# Altium schematic sheet [04] - MCU STM32.SchDoc
size A3; CompanyName: FPT-FTI copporation; Address1: FPT Building Duy Tan; Address2: Floor 4,; DocumentNumber: 4; SheetNumber: 4; SheetTotal: 8; NameAuthor: Angle Vu
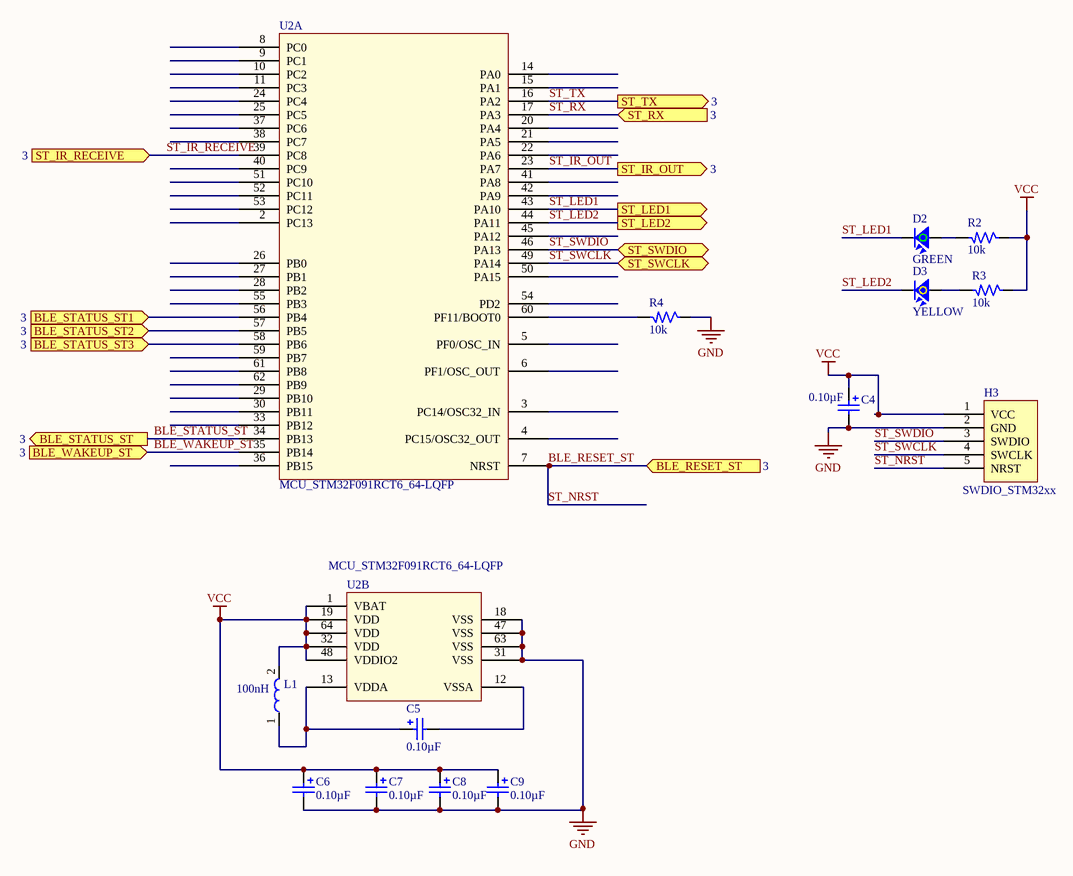
[diagram p0: [04] - MCU STM32.SchDoc]

## Parts
C4  Capacitance: 0.10µF  [CAP_SMD0603]  (hidden comment: C_104_0603_CERAMIC_16V)
C5  Capacitance: 0.10µF  [CAP_SMD0603]  (hidden comment: C_104_0603_CERAMIC_16V)
C6  Capacitance: 0.10µF  [CAP_SMD0603]  (hidden comment: C_104_0603_CERAMIC_16V)
C7  Capacitance: 0.10µF  [CAP_SMD0603]  (hidden comment: C_104_0603_CERAMIC_16V)
C8  Capacitance: 0.10µF  [CAP_SMD0603]  (hidden comment: C_104_0603_CERAMIC_16V)
C9  Capacitance: 0.10µF  [CAP_SMD0603]  (hidden comment: C_104_0603_CERAMIC_16V)
D2  GREEN  [LED_GREEN_SMD0603]
D3  YELLOW  [LED_YELLOW_SMD0603]
H3  SWDIO_STM32xx  [HEADER5_ISP_STM32F0xx_SUR1.27 - duplicate]
L1  Inductance: 100nH  [CHOKE_SMD0805]  (hidden comment: CHOKE_100NH_SMD0805)
R2  Resistance (Ohms): 10k  [RES_SMD0603]  (hidden comment: R_10K_SMD0603_1%_1/10W)
R3  Resistance (Ohms): 10k  [RES_SMD0603]  (hidden comment: R_10K_SMD0603_1%_1/10W)
R4  Resistance (Ohms): 10k  [RES_SMD0603]  (hidden comment: R_10K_SMD0603_1%_1/10W)
U2  MCU_STM32F091RCT6_64-LQFP  [MCU_STM32F091RCT6_LQFP64]  (parts A,B of 2)

## Ports
BLE_RESET_ST (in, see 3), BLE_STATUS_ST1 (in, see 3), BLE_STATUS_ST2 (in, see 3), BLE_STATUS_ST3 (in, see 3), BLE_STATUS_ST (out, see 3), BLE_WAKEUP_ST (in, see 3), ST_IR_OUT (out, see 3), ST_IR_RECEIVE (in, see 3), ST_LED1 (out), ST_LED2 (out), ST_RX (in, see 3), ST_SWCLK (bidir), ST_SWDIO (bidir), ST_TX (out, see 3)

## Nets
GND: C4.2 C6.2 C7.2 C8.2 C9.2 H3.2(GND) R4.1 U2.18(VSS) U2.31(VSS) U2.47(VSS) U2.63(VSS)
VCC: C4.1 C6.1 C7.1 C8.1 C9.1 H3.1(VCC) L1.2 R2.1 R3.1 U2.1(VBAT) U2.19(VDD) U2.32(VDD) U2.48(VDDIO2) U2.64(VDD)
BLE_RESET_ST: H3.5(NRST) U2.7(NRST) ; port BLE_RESET_ST  [also labelled ST_NRST]
BLE_STATUS_ST: U2.34(PB13) ; port BLE_STATUS_ST
BLE_STATUS_ST1: U2.56(PB4) ; port BLE_STATUS_ST1
BLE_STATUS_ST2: U2.57(PB5) ; port BLE_STATUS_ST2
BLE_STATUS_ST3: U2.58(PB6) ; port BLE_STATUS_ST3
BLE_WAKEUP_ST: U2.35(PB14) ; port BLE_WAKEUP_ST
ST_IR_OUT: U2.23(PA7) ; port ST_IR_OUT
ST_IR_RECEIVE: U2.39(PC8) ; port ST_IR_RECEIVE
ST_LED1: D2.2 U2.43(PA10) ; port ST_LED1
ST_LED2: D3.2 U2.44(PA11) ; port ST_LED2
ST_RX: U2.17(PA3) ; port ST_RX
ST_SWCLK: H3.4(SWCLK) U2.49(PA14) ; port ST_SWCLK
ST_SWDIO: H3.3(SWDIO) U2.46(PA13) ; port ST_SWDIO
ST_TX: U2.16(PA2) ; port ST_TX
NetC5_1: C5.1 L1.1 U2.13(VDDA)
NetC5_2: C5.2 U2.12(VSSA)
NetD2_1: D2.1 R2.2
NetD3_1: D3.1 R3.2
NetR4_2: R4.2 U2.60(PF11/BOOT0)

Not connected (* = marked no-connect by the designer): U2 2(PC13) 3(PC14/OSC32_IN) 4(PC15/OSC32_OUT) 5(PF0/OSC_IN) 6(PF1/OSC_OUT) 8(PC0) 9(PC1) 10(PC2) 11(PC3) 14(PA0) 15(PA1) 20(PA4) 21(PA5) 22(PA6) 24(PC4) 25(PC5) 26(PB0) 27(PB1) 28(PB2) 29(PB10) 30(PB11) 33(PB12) 36(PB15) 37(PC6) 38(PC7) 40(PC9) 41(PA8) 42(PA9) 45(PA12) 50(PA15) 51(PC10) 52(PC11) 53(PC12) 54(PD2) 55(PB3) 59(PB7) 61(PB8) 62(PB9)

## Notes on the sheet
- Designed By
- Checked By
- Company:
- Size:
- A3
- Address:
- Sheet:
- /

## Library data of the parts
C4-C9 = C_104_0603_CERAMIC_16V: CAP CER 0.1UF 16V X7R 0603; Manufacturer: Murata Electronics North America; Manufacturer Part Number: GRM188R71C104KA01D; Tolerance: ±10%; Supplier 1: Digi-Key; RoHS: RoHS Compliant; Category: Capacitors; Stock 1: 3132000; Pricing 1: 4000=0.00359, 8000=0.00328, 12000=0.00312, 28000=0.00296, 100000=0.00215 (USD); Packaging: Tape & Reel (TR); Part Status: Active; Voltage - Rated: 16V; Temperature Coefficient: X7R; Mounting Type: Surface Mount, MLCC; Operating Temperature: -55°C ~ 125°C; Applications: General Purpose; Ratings: -; Package / Case: 0603 (1608 Metric); Size / Dimension: 0.063" L x 0.031" W (1.60mm x 0.80mm); Height - Seated (Max): -; Thickness (Max): 0.035" (0.90mm); Lead Spacing: -; Features: -; Lead Style: -; ComponentLink1URL: http://www.murata.com/~/media/webrenewal/support/library/catalog/products/capacitor/mlcc/c02e.pdf; ComponentLink1Description: http://www.murata.com/~/media/webrenewal/support/library/catalog/products/capacitor/mlcc/c02e.pdf; Supplier Part Number 1: 490-1532-2-ND
D2 = LED2_GREEN_0603_2V: LED GREEN CLEAR 0603 SMD; Manufacturer: Lite-On Inc.; Manufacturer Part Number: LTST-C191KGKT; Lens Color: Colorless; Millicandela Rating: 35mcd; Lens Style/Size: Rectangle with Flat Top, 1.10mm x 0.80mm; Voltage - Forward (Vf) (Typ): 2V; Current - Test: 20mA; Viewing Angle: 130°; Wavelength - Dominant: 571nm; Wavelength - Peak: 574nm; Supplier 1: Digi-Key; RoHS: RoHS Compliant; Category: Optoelectronics; Stock 1: 960000; Pricing 1: 5000=0.0404, 10000=0.03636, 25000=0.03232, 50000=0.02929, 125000=0.02727 (USD); Packaging: Tape & Reel (TR); Part Status: Active; Color: Green; Lens Transparency: Clear; Mounting Type: Surface Mount; Features: -; Package / Case: 0603 (1608 Metric); Supplier Device Package: *; Size / Dimension: 1.60mm L x 0.80mm W; Height (Max): 0.55mm; ComponentLink1URL: http://optoelectronics.liteon.com/upload/download/DS22-2000-228/S_110_LTST-C191KGKT.pdf; ComponentLink1Description: http://optoelectronics.liteon.com/upload/download/DS22-2000-228/S_110_LTST-C191KGKT.pdf; Supplier Part Number 1: 160-1446-2-ND
D3 = LED2_YELLOW_0603_2.1V: LED YELLOW CLEAR 0603 SMD; Manufacturer: Lite-On Inc.; Manufacturer Part Number: LTST-C191KSKT; Lens Color: Colorless; Millicandela Rating: 104mcd; Lens Style/Size: Rectangle with Flat Top, 1.10mm x 0.80mm; Voltage - Forward (Vf) (Typ): 2.1V; Current - Test: 20mA; Viewing Angle: 130°; Wavelength - Dominant: 591nm; Wavelength - Peak: 588nm; Supplier 1: Digi-Key; RoHS: RoHS Compliant; Category: Optoelectronics; Stock 1: 280000; Pricing 1: 5000=0.043, 10000=0.0387, 25000=0.0344, 50000=0.03118, 125000=0.02903 (USD); Packaging: Tape & Reel (TR); Part Status: Active; Color: Yellow; Lens Transparency: Clear; Mounting Type: Surface Mount; Features: -; Package / Case: 0603 (1608 Metric); Supplier Device Package: *; Size / Dimension: 1.60mm L x 0.80mm W; Height (Max): 0.55mm; ComponentLink1URL: http://optoelectronics.liteon.com/upload/download/DS22-2000-224/S_110_LTST-C191KSKT.pdf; ComponentLink1Description: http://optoelectronics.liteon.com/upload/download/DS22-2000-224/S_110_LTST-C191KSKT.pdf; Supplier Part Number 1: 160-1448-2-ND
H3 = HEADER5_ISP_STM32xx_HOLE_2.54: CONN HEADER 5 POS 2.54; Manufacturer: Wurth Electronics Inc; Manufacturer Part Number: 61300511121; Connector Type: Header, Unshrouded; Number of Positions: 5; Number of Positions Loaded: All; Pitch: 0.100" (2.54mm); Supplier 1: Digi-Key; RoHS: RoHS Compliant; Category: Connectors, Interconnects; Stock 1: 5098; Pricing 1: 1=0.23, 100=0.2106, 500=0.1782 (USD); Packaging: Bulk; Part Status: Active; Contact Type: Male Pin; Number of Rows: 1; Row Spacing: -; Contact Mating Length: 0.236" (6.00mm); Mounting Type: Through Hole; Termination: Solder; Fastening Type: -; Features: -; Contact Finish: Gold; Contact Finish Thickness: -; Color: Black; ComponentLink1URL: http://katalog.we-online.de/em/datasheet/6130xx11121.pdf; ComponentLink1Description: http://katalog.we-online.de/em/datasheet/6130xx11121.pdf; Supplier Part Number 1: 732-5318-ND
L1 = CHOKE_100NH_SMD0805: FIXED IND 100NH 300MA 900 MOHM; Manufacturer: Jaro Components Inc.; Manufacturer Part Number: HFI-201209-R10J; Type: Wirewound; Material - Core: Ceramic; Tolerance: ±5%; Shielding: Unshielded; DC Resistance (DCR): 900 mOhm Max; Q @ Freq: 18 @ 100MHz; Frequency - Self Resonant: 600MHz; Frequency - Test: 100MHz; Supplier 1: Digi-Key; RoHS: Request Inventory Verification; Category: Inductors, Coils, Chokes; Stock 1: 513; Pricing 1: 1=0.11, 10=0.107, 25=0.1052, 250=0.10312, 500=0.10106 (USD); Packaging: Cut Tape (CT); Part Status: Discontinued; Current Rating: 300mA; Current - Saturation: -; Ratings: -; Operating Temperature: -; Mounting Type: Surface Mount; Package / Case: 0805 (2012 Metric); Size / Dimension: 0.079" L x 0.049" W (2.00mm x 1.25mm); Height - Seated (Max): 0.043" (1.10mm); ComponentLink1URL: http://www.jarocomponents.com/1043spec/InductorsChipSurfaceMount/Jaro_Ind_Chip_SM_HFI_HighFrequencyMultilayer.pdf; ComponentLink1Description: http://www.jarocomponents.com/1043spec/InductorsChipSurfaceMount/Jaro_Ind_Chip_SM_HFI_HighFrequencyMultilayer.pdf; Supplier Part Number 1: 334-1072-1-ND
R2-R4 = R_10K_SMD0603_1%_1/10W: RES SMD 10K OHM 1% 1/10W 0603; Manufacturer: Yageo; Manufacturer Part Number: RC0603FR-0710KL; Power (Watts): 0.1W, 1/10W; Temperature Coefficient: ±100ppm/°C; Capacitance: 0.10µF; Voltage - Rated: 50V; Supplier 1: Digi-Key; RoHS: RoHS Compliant; Category: Resistors; Stock 1: 10005000; Pricing 1: 5000=0.00167, 10000=0.00145, 25000=0.00128, 50000=0.00117, 125000=0.00115 (USD); Packaging: Tape & Reel (TR); Part Status: Active; Tolerance: ±1%; Composition: Thick Film; Features: Moisture Resistant; Operating Temperature: -55°C ~ 155°C; Package / Case: 0603 (1608 Metric); Supplier Device Package: 0603; Size / Dimension: 0.063" L x 0.031" W (1.60mm x 0.80mm); Height: 0.022" (0.55mm); Number of Terminations: 2; ComponentLink1URL: http://www.yageo.com/documents/recent/PYu-RC_Group_51_RoHS_L_04.pdf; ComponentLink1Description: http://www.yageo.com/documents/recent/PYu-RC_Group_51_RoHS_L_04.pdf; Supplier Part Number 1: 311-10.0KHRTR-ND; Mounting Type: Surface Mount, MLCC; Applications: General Purpose; Ratings: -; Height - Seated (Max): -; Thickness (Max): 0.037" (0.94mm); Lead Spacing: -; Lead Style: -; ComponentLink2URL: http://datasheets.avx.com/X7RDielectric.pdf; ComponentLink2Description: http://datasheets.avx.com/X7RDielectric.pdf
U2 = MCU_STM32F091RCT6_64-LQFP: IC MCU 32BIT 256KB FLASH 64LQFP; Manufacturer: STMicroelectronics; Core Processor: ARM® Cortex®-M0; Core Size: 32-Bit; Speed: 48MHz; Connectivity: CAN, I²C, IrDA, LIN, SPI, UART/USART; Peripherals: DMA, I²S, POR, PWM, WDT; Number of I/O: 52; Program Memory Size: 256KB (256K x 8); RAM Size: 32K x 8; Voltage - Supply (Vcc/Vdd): 2 V ~ 3.6 V; Data Converters: A/D 19x12b, D/A 2x12b; Oscillator Type: Internal; Supplier 1: Digi-Key; Manufacturer Part Number: STM32F091RCT6; RoHS: RoHS Compliant; Category: Integrated Circuits (ICs); Stock 1: 0; Pricing 1: 1=4.47, 10=4.013, 100=3.2877, 500=2.79876, 1000=2.3604 (USD); Packaging: Tray; Part Status: Active; Program Memory Type: FLASH; EEPROM Size: -; Operating Temperature: -40°C ~ 85°C (TA); Package / Case: 64-LQFP; Supplier Device Package: 64-LQFP (10x10); ComponentLink1URL: http://www.st.com/web/en/resource/technical/document/datasheet/DM00115237.pdf; ComponentLink1Description: http://www.st.com/web/en/resource/technical/document/datasheet/DM00115237.pdf; Supplier Part Number 1: 497-15167-ND